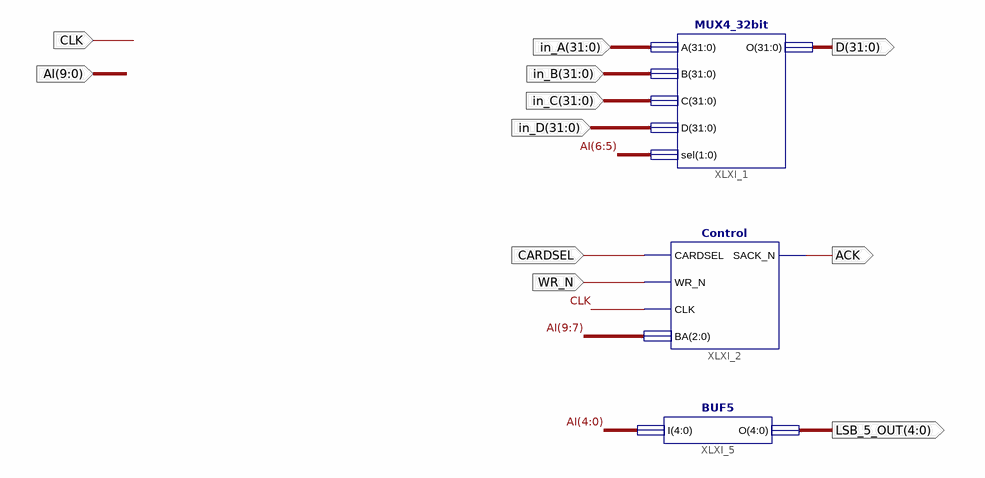
[diagram p0: schematic sheet 1]
// Xilinx ISE schematic top_slave.sch (spartan6) as structural Verilog: 3 symbols, 11 ports
module top_slave (
  input  CLK,
  input  [9:0] AI,
  input  [31:0] in_B,
  input  [31:0] in_A,
  input  [31:0] in_C,
  input  [31:0] in_D,
  input  CARDSEL,
  input  WR_N,
  output [31:0] D,
  output ACK,
  output [4:0] LSB_5_OUT
);

  MUX4_32bit XLXI_1 (.A(in_A), .B(in_B), .C(in_C), .D(in_D), .sel(AI[6:5]), .O(D));
  Control XLXI_2 (.CARDSEL(CARDSEL), .WR_N(WR_N), .CLK(CLK), .BA(AI[9:7]), .SACK_N(ACK));
  BUF5 XLXI_5 (.I(AI[4:0]), .O(LSB_5_OUT));
endmodule
